# EasyEDA Pro project MSDRV4.eprj, board PCB10_1
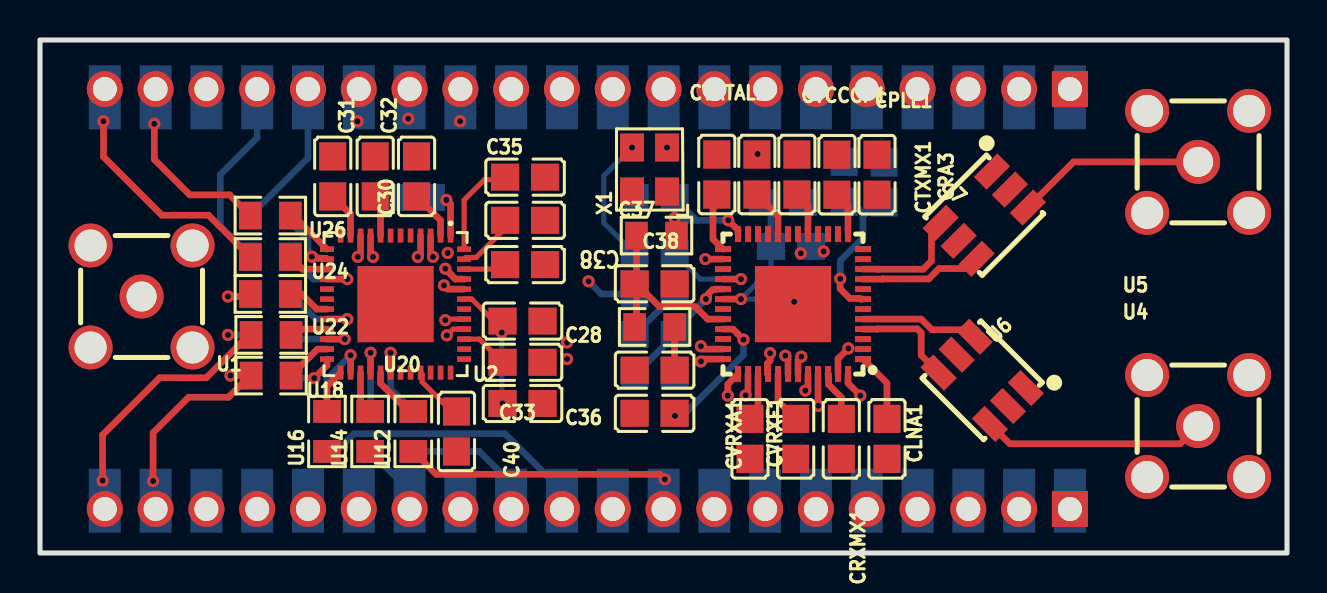
[diagram p10: board, top side]
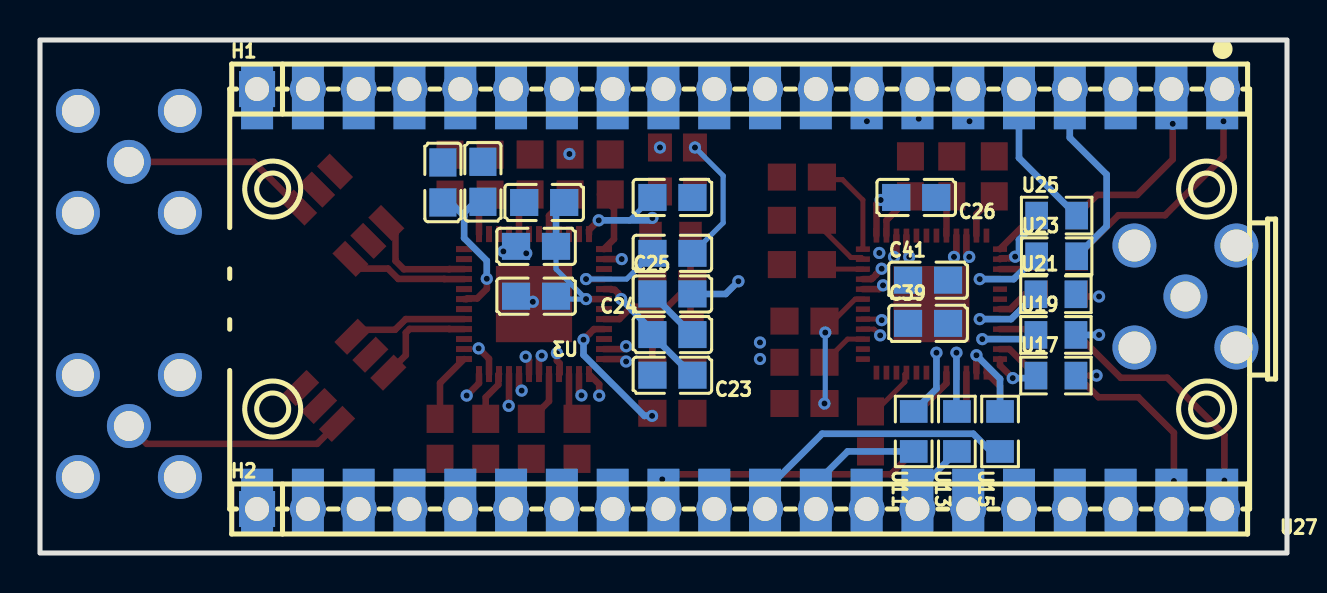
[diagram p11: board, bottom side, seen from below]

Outline 62.36 x 25.65 mm; copper layers: Top Layer, GND, Inner2, Inner3, 3.3, Bottom Layer. Coordinates in mm from the lower left corner of the outline.
Outline path: rectangle 0,25.65 62.36,0
Stack: Top Layer 0.035mm Outer layer thickness 1oz / Dielectric1 0.0994mm 3313 RC57% 4.2mil / GND 0.0152mm Inner layer thickness / Dielectric2 0.55mm 0.55mm H/H No copper / Inner2 0.0152mm Inner layer thickness / Dielectric3 0.1088mm 2116 RC54% 4.9mil / Inner3 0.0152mm Inner layer thickness / Dielectric4 0.55mm 0.55mm H/H No copper / 3.3 0.0152mm Inner layer thickness / Dielectric5 0.0994mm 3313 RC57% 4.2mil / Bottom Layer 0.035mm Outer layer thickness 1oz

## Design rules (mm)
net $1I297\RXP: $1I297\RX
net $1I297\RXN: $1I297\RX
net $1I297\TXP: $1I297\TX
net $1I297\TXN: $1I297\TX
net RXQN: RXQ
net RXQP: RXQ
net RXIN: RXI
net RXIP: RXI
net TXQN: TXQ
net TXQP: TXQ
net TXIN: TXI
net TXIP: TXI
template: JLCPCB Capability(Two Layers Board)
spacing copperThickness1oz (default): track to track 0.102, other pairs 0.152 to 0.3
spacing copperThickness2oz: track to track 0.203, other pairs 0.152 to 0.3
track width copperThickness1oz (default): min 0.127, default 0.254, max 2.54
track width copperThickness2oz: min 0.203, default 0.254, max 2.54
differential pair differentialPair (default): width min 0.127, default 0.254, max 2.54; gap min 0.152, default 0.152
via viaSize (default): diameter min 0.5, default 0.61, max 10; hole min 0.3, default 0.305, max 6.3

## Placement (name value [footprint] x y rotation side)
C18  100nF  [C0805]  30.73 6.98 0 top
C19  1nF  [C0805]  30.73 14.99 0 bottom
C20  100pF  [C0805]  30.73 17.78 0 bottom
C21  2200pF  [C0805]  30.73 9.14 0 top
C22  68pF  [C0805]  30.73 13.46 180 top
C23  18pF  [C0805]  30.73 8.89 0 bottom
C24  100nF  [C0805]  30.73 10.92 180 bottom
C25  100nF  [C0805]  30.73 12.95 180 bottom
C26  330nF  [C0805]  18.54 17.78 0 bottom
C28  100nF  [C0805]  24.13 11.6 180 top
C30  100nF  [C0805]  18.83 18.83 90 top
C31  100nF  [C0805]  14.64 18.83 270 top
C32  100nF  [C0805]  16.76 18.83 270 top
C33  100nF  [C0805]  24.13 9.54 0 top
C35  330nF  [C0805]  24.26 18.8 0 top
C36  100nF  [C0805]  24.13 7.48 180 top
C37  330nF  [C0805]  24.26 16.64 180 top
C38  100nF  [C0805]  24.26 14.42 180 top
C39  100nF  [C0805]  17.95 11.48 180 bottom
C40  100nF  [C0805]  20.83 6.08 90 top
C41  100nF  [C0805]  17.95 13.64 180 bottom
CLNA1  100pF  [C0805]  42.35 5.71 270 top
CPA1  10uF  [C0805]  40.21 18.56 90 bottom
CPA2  10uF  [C0805]  42.21 18.53 90 bottom
CPA3  100nF  [C0805]  41.85 18.92 90 top
CPLL1  100pF  [C0805]  37.85 18.93 90 top
CRXMX1  100pF  [C0805]  40.07 5.71 270 top
CTXMX1  100pF  [C0805]  39.85 18.92 90 top
CVCCCP1  10nF  [C0805]  35.85 18.93 90 top
CVCO0  100pF  [C0805]  37.55 15.33 0 bottom
CVCO1  100pF  [C0805]  37.55 12.84 0 bottom
CVCO2  100pF  [C0805]  37.15 17.53 0 bottom
CVRXA1  100pF  [C0805]  35.5 5.71 270 top
CVRXF1  100pF  [C0805]  37.79 5.71 270 top
CVXTAL1  100pF  [C0805]  33.84 18.93 90 top
H1  -  [HDR-TH_20P-P2.54-V-M-1]  27.37 23.2 180 bottom
H2  -  [HDR-TH_20P-P2.54-V-M-1]  27.37 2.2 180 bottom
U1  MCX5.08-H5  [SMA-TH_MCX5.08-H5]  5.08 12.83 180 top
U2  MAX5864ETM+  [QFN-48_L7.0-W7.0-P0.50-BL-EP5.1]  17.78 12.45 180 top
U3  MAX2831ETM+T  [TQFN-48_L7.0-W7.0-P0.50-TL-EP5.6]  37.65 12.45 180 top
U4  MCX5.08-H5  [SMA-TH_MCX5.08-H5]  57.91 6.35 0 top
U5  MCX5.08-H5  [SMA-TH_MCX5.08-H5]  57.91 19.56 0 top
U6  TCM2-43X+  [IND-SMD_6P-L4.1-W3.8-P1.27-TL]  47.12 8.64 225 top
U7  TCM2-43X+  [IND-SMD_6P-L4.1-W3.8-P1.27-TL]  47.22 16.89 315 top
U8  1.2K  [R0805]  30.73 11.3 0 top
U9  750  [R0805]  30.83 15.88 0 top
U11  100  [R0805]  18.67 6.08 90 bottom
U12  100  [R0805]  18.67 6.08 90 top
U13  100  [R0805]  16.51 6.08 90 bottom
U14  100  [R0805]  16.51 6.08 90 top
U15  100  [R0805]  14.35 6.08 90 bottom
U16  100  [R0805]  14.35 6.08 90 top
U17  100  [R0805]  11.56 8.87 180 bottom
U18  100  [R0805]  11.56 8.87 180 top
U19  100  [R0805]  11.56 10.91 180 bottom
U20  100  [R0805]  11.56 10.91 180 top
U21  100  [R0805]  11.56 12.94 180 bottom
U22  100  [R0805]  11.52 12.95 180 top
U23  100  [R0805]  11.52 14.84 180 bottom
U24  100  [R0805]  11.52 14.8 180 top
U25  100  [R0805]  11.52 16.87 180 bottom
U26  100  [R0805]  11.52 16.87 180 top
U27  PICO  [comm-smd_l51.0-w21.0-p2.54_sc0916]  27.69 12.7 0 bottom
X1  40MHz  [OSC-SMD_4P-L3.2-W2.5-BL]  30.48 19.18 90 top

## Footprints (pads in the part's own frame, mm; a bottom-side part is the same pattern mirrored in y, then rotated)
C0805
  rect 1.41x1.35 smd: 1(-1,0) 2(1,0)
comm-smd_l51.0-w21.0-p2.54_sc0916
  rect 1.6x3.2 smd: 1(-24.445,-10.088) 2(-21.905,-10.088) 3(-19.365,-10.088) 4(-16.825,-10.088) 5(-14.285,-10.088) 6(-11.745,-10.088) 7(-9.205,-10.088) 8(-6.665,-10.088) 9(-4.125,-10.088) 10(-1.585,-10.088) 11(0.955,-10.088) 12(3.495,-10.088) 13(6.035,-10.088) 14(8.575,-10.088) 15(11.115,-10.088) 16(13.655,-10.088) 17(16.195,-10.088) 18(18.735,-10.088) 19(21.275,-10.088) 20(23.815,-10.088) 21(23.815,10.088) 22(21.275,10.088) 23(18.735,10.088) 24(16.195,10.088) 25(13.655,10.088) 26(11.115,10.088) 27(8.575,10.088) 28(6.035,10.088) 29(3.495,10.088) 30(0.955,10.088) 31(-1.585,10.088) 32(-4.125,10.088) 33(-6.665,10.088) 34(-9.205,10.088) 35(-11.745,10.088) 36(-14.285,10.088) 37(-16.825,10.088) 38(-19.365,10.088) 39(-21.905,10.088) 40(-24.445,10.088)
HDR-TH_20P-P2.54-V-M-1
  rect 1.8x1.8 hole 1.2: 1(-24.13,0)
  round 1.8 hole 1.2: 2(-21.59,0) 3(-19.05,0) 4(-16.51,0) 5(-13.97,0) 6(-11.43,0) 7(-8.89,0) 8(-6.35,0) 9(-3.81,0) 10(-1.27,0) 11(1.27,0) 12(3.81,0) 13(6.35,0) 14(8.89,0) 15(11.43,0) 16(13.97,0) 17(16.51,0) 18(19.05,0) 19(21.59,0) 20(24.13,0)
IND-SMD_6P-L4.1-W3.8-P1.27-TL
  rect 0.9x1.657 smd: 1(-1.27,1.813) 2(0,1.813) 3(1.27,1.813) 4(1.27,-1.813) 5(0,-1.813) 6(-1.27,-1.813)
OSC-SMD_4P-L3.2-W2.5-BL
  rect 1.4x1.2 smd: 1(-1.1,-0.875) 2(1.1,-0.875) 3(1.1,0.875) 4(-1.1,0.875)
QFN-48_L7.0-W7.0-P0.50-BL-EP5.1
  rect 0.28x0.7 smd: 1(-2.75,-3.428) 2(-2.25,-3.428) 3(-1.75,-3.428) 4(-1.25,-3.428) 5(-0.75,-3.428) 6(-0.25,-3.428) 7(0.25,-3.428) 8(0.75,-3.428) 9(1.25,-3.428) 10(1.75,-3.428) 11(2.25,-3.428) 12(2.75,-3.428) 25(2.75,3.428) 26(2.25,3.428) 27(1.75,3.428) 28(1.25,3.428) 29(0.75,3.428) 30(0.25,3.428) 31(-0.25,3.428) 32(-0.75,3.428) 33(-1.25,3.428) 34(-1.75,3.428) 35(-2.25,3.428) 36(-2.75,3.428)
  rect 0.7x0.28 smd: 13(3.428,-2.75) 14(3.428,-2.25) 15(3.428,-1.75) 16(3.428,-1.25) 17(3.428,-0.75) 18(3.428,-0.25) 19(3.428,0.25) 20(3.428,0.75) 21(3.428,1.25) 22(3.428,1.75) 23(3.428,2.25) 24(3.428,2.75) 37(-3.428,2.75) 38(-3.428,2.25) 39(-3.428,1.75) 40(-3.428,1.25) 41(-3.428,0.75) 42(-3.428,0.25) 43(-3.428,-0.25) 44(-3.428,-0.75) 45(-3.428,-1.25) 46(-3.428,-1.75) 47(-3.428,-2.25) 48(-3.428,-2.75)
  rect 3.81x3.81 smd: 49(0,0)
R0805
  rect 1.133x1.377 smd: 1(-1,0) 2(1,0)
SMA-TH_MCX5.08-H5
  round 2.2 hole 1.6: 1(-2.55,-2.55) 2(-2.55,2.55) 3(2.55,2.55) 4(2.55,-2.55)
  round 2.2 hole 1.5: 5(0,0)
TQFN-48_L7.0-W7.0-P0.50-TL-EP5.6
  rect 0.8x0.3 smd: 1(-3.5,2.751) 2(-3.5,2.251) 3(-3.5,1.75) 4(-3.5,1.251) 5(-3.5,0.75) 6(-3.5,0.252) 7(-3.5,-0.249) 8(-3.5,-0.75) 9(-3.5,-1.25) 10(-3.5,-1.75) 11(-3.5,-2.249) 12(-3.5,-2.748) 25(3.5,-2.748) 26(3.5,-2.249) 27(3.5,-1.75) 28(3.5,-1.25) 29(3.5,-0.75) 30(3.5,-0.249) 31(3.5,0.252) 32(3.5,0.75) 33(3.5,1.251) 34(3.5,1.75) 35(3.5,2.251) 36(3.5,2.751)
  rect 0.3x0.8 smd: 13(-2.751,-3.5) 14(-2.251,-3.5) 15(-1.75,-3.5) 16(-1.25,-3.5) 17(-0.75,-3.5) 18(-0.251,-3.5) 19(0.249,-3.5) 20(0.75,-3.5) 21(1.25,-3.5) 22(1.75,-3.5) 23(2.251,-3.5) 24(2.751,-3.5) 37(2.751,3.5) 38(2.251,3.5) 39(1.75,3.5) 40(1.25,3.5) 41(0.75,3.5) 42(0.251,3.5) 43(-0.251,3.5) 44(-0.75,3.5) 45(-1.25,3.5) 46(-1.75,3.5) 47(-2.251,3.5) 48(-2.751,3.5)
  rect 3.81x3.81 smd: 49(0,0.001)

## Nets
+5V: X1.4
GND: C18.1 C20.1 C21.1 C22.1 C23.2 C26.1 C28.1 C30.2 C31.1 C32.1 C33.2 C35.2 C36.1 C37.1 C38.1 C39.1 C40.1 C41.1 CLNA1.2 CPA1.2 CPA2.2 CPA3.2 CPLL1.2 CRXMX1.2 CTXMX1.2 CVCCCP1.2 CVCO0.2 CVCO1.2 CVCO2.2 CVRXA1.2 CVRXF1.2 CVXTAL1.2 U1.1 U1.2 U1.3 U1.4 U2.5 U2.7 U2.12 U2.31 U2.32 U2.37 U2.42 U3.2 U3.26 U3.31 U3.47 U3.49 U4.1 U4.2 U4.3 U4.4 U5.1 U5.2 U5.3 U5.4 U6.1 U6.2 U7.1 U7.2 X1.2
VCC: C28.2 C30.1 C31.2 C32.2 C33.1 C36.2 C38.2 C39.2 C40.2 C41.2 U2.2 U2.8 U2.11 U2.18 U2.33 U2.39 U2.43 U2.46
3.3: CLNA1.1 CPA1.1 CPA2.1 CPA3.1 CPLL1.1 CRXMX1.1 CTXMX1.1 CVCCCP1.1 CVCO0.1 CVCO1.1 CVCO2.1 CVRXA1.1 CVRXF1.1 CVXTAL1.1 U3.1 U3.7 U3.13 U3.17 U3.20 U3.25 U3.27 U3.30 U3.39 U3.41 U3.46
$1I61\$1N1602: C37.2 U2.47
$1I61\$1N1605: U2.30 U11.2
$1I61\$1N1608: U2.29 U12.2
$1I61\$1N1611: U2.28 U13.2
$1I61\$1N1614: U2.27 U14.2
$1I61\$1N1617: U2.26 U15.2
$1I61\$1N1620: U2.25 U16.2
$1I61\$1N1625: U2.24 U17.1
$1I61\$1N1628: U2.23 U18.1
$1I61\$1N1633: U2.21 U20.1
$1I61\$1N1636: U2.20 U21.1
$1I61\$1N1639: U2.19 U22.1
$1I61\$1N1642: U2.16 U23.1
$1I61\$1N1645: U2.15 U24.1
$1I61\$1N1648: U2.14 U25.1
$1I61\$1N1651: U2.13 U26.1
$1I61\$1N1653: C35.1 U2.48
$1I61\$1N1654: C26.2 U2.1
$1I61\$1N1662: U2.22 U19.1
$1I61\BBC_CLK: U2.6
$1I61\BBC_DA0: U26.2 U27.2
$1I61\BBC_DA1: U25.2 U27.5
$1I61\BBC_DA2: U24.2 U27.1
$1I61\BBC_DA3: U23.2 U27.4
$1I61\BBC_DA4: U22.2 U27.6
$1I61\BBC_DA5: U21.2
$1I61\BBC_DA6: U20.2 U27.40
$1I61\BBC_DA7: U19.2 U27.7
$1I61\BBC_DD0: U18.2 U27.8 U27.39
$1I61\BBC_DD1: U17.2
$1I61\BBC_DD2: U16.1
$1I61\BBC_DD3: U15.1 U27.31
$1I61\BBC_DD4: U14.1
$1I61\BBC_DD5: U13.1 U27.34
$1I61\BBC_DD6: U12.1 U27.29
$1I61\BBC_DD7: U11.1 U27.32
$1I61\CS#: U2.36
$1I61\DIN: U2.34
$1I61\SCLK: U2.35
$1I297\$1N1513: U4.5 U6.3
$1I297\$1N1514: U5.5 U7.3
$1I297\$1N1515: C21.2 U8.2
$1I297\$1N2254: C23.1 C24.1 U3.29
$1I297\$1N2490: C19.1 X1.3
$1I297\$1N3884: C25.2 U1.5
$1I297\BYPASS: C18.2 U3.33
$1I297\CLKBUF: U3.21
$1I297\CPOUT: C20.2 U3.24 U9.2
$1I297\CS#: U3.15
$1I297\D1: U3.23
$1I297\D2: U3.11
$1I297\D3: U3.8
$1I297\D4: U3.34
$1I297\D5: U3.14
$1I297\D6: U3.3
$1I297\D7: U3.6
$1I297\DIN: U3.19
$1I297\PLL_LOCK: U3.22
$1I297\RSSI: U3.16
$1I297\RXHP: U3.40
$1I297\RXN: U3.5 U6.6
$1I297\RXP: U3.4 U6.4
$1I297\RXTX_MODE: U3.48
$1I297\SCLK: U3.18
$1I297\SHDN#: U3.12 X1.1
$1I297\TUNE: C22.2 U3.32 U8.1 U9.1
$1I297\TXN: U3.10 U7.6
$1I297\TXP: U3.9 U7.4
$1I297\XTAL: C19.2 C24.2 C25.1 U3.28
RXIN: U2.4 U3.37
RXIP: U2.3 U3.38
RXQN: U2.9 U3.35
RXQP: U2.10 U3.36
TXIN: U2.44 U3.44
TXIP: U2.45 U3.45
TXQN: U2.40 U3.42
TXQP: U2.41 U3.43

Pads without a net: H1 1 2 3 4 5 6 7 8 9 10 11 12 13 14 15 16 17 18 19 20; H2 1 2 3 4 5 6 7 8 9 10 11 12 13 14 15 16 17 18 19 20; U2 17 38 49; U6 5; U7 5; U27 3 9 10 11 12 13 14 15 16 17 18 19 20 21 22 23 24 25 26 27 28 30 33 35 36 37 38

## Via types
v1: diameter 0.61, hole 0.305, Top Layer to Bottom Layer, 60 vias

## Routing (per net, layer and track width the routed paths; a pad name or vN(x,y) marks a point on that pad's centre or on a via; arc(x,y) is an arc through that point)
GND: length 2.4
  Top Layer w0.33: U3.47 39.9,9.71 v1(40.42,10.23) ; 34.15,14.7 33.27,14.7
  vias: v1(31.36,20.28) v1(33.27,14.7) v1(35.88,19.95) v1(37.71,12.56) v1(38.04,14.99) v1(39.19,15.08)
VCC: length 20
  Top Layer w0.254: v1(23.09,11.02) 23.09,11.56 C28.2 22.69,11.6 21.59,12.7 U2.43 ; 22.59,14.2 U2.46 ; C33.1 21.97,10.7 U2.39 ; U2.33 19.11,8.94 19.11,8.55 20.58,7.08 C40.2
  Top Layer w0.33: C31.2 15.53,16.94 U2.11 ; U2.8 17.03,17.56 C32.2 ; C30.1 20.03,16.63 U2.2
  Bottom Layer w0.254: v1(23.09,11.02) 23.09,7.52 v1(23.13,7.48)
3.3: length 37.6
  Top Layer w0.33: U3.30 v1(35.05,12.7) ; U3.13 40.4,17.36 CTXMX1.1 ; U3.7 41.03,12.7 40.99,12.73 40.5,12.73 40.01,13.22 40.01,13.71 v1(40.02,13.71) ; U3.41 36.9,7.59 CVRXF1.1 ; CPLL1.1 38.4,17.37 U3.17 ; 34.35,17.93 33.65,17.23 33.65,15.7 U3.25 ; CVRXA1.1 35.9,7.11 U3.39 ; CLNA1.1 42.35,8.5 41.15,9.7 ; U3.46 39.44,8.91 39.44,8.42 40.07,7.78 CRXMX1.1 ; U3.20 36.9,16.87 CVCCCP1.1
  Bottom Layer w0.254: CVCO1.1 36.41,12.7 v1(35.05,12.7) 36.55,14.2 CVCO0.1
  Bottom Layer w0.33: 40.21,17.94 41.15,17 41.15,16.85 ; 41.15,16.85 41.15,15.75 40.02,14.62 v1(40.02,13.71) ; 41.15,16.85 42.21,17.91 ; CVCO2.1 36.55,17.12 CVCO0.1
  vias: v1(20.39,15)
$1I61\$1N1602: length 3.1
  Top Layer w0.254: C37.2 23.13,16.51 23.13,16.1 21.81,14.78 21.29,14.78 U2.47
$1I61\$1N1605: length 4.4
  Top Layer w0.33: U2.30 v1(17.53,10.02)
  Bottom Layer w0.33: v1(17.53,10.02) 17.53,8.22 U11.2
$1I61\$1N1608: length 2.8
  Top Layer w0.33: U2.29 17.03,8.48 18.43,7.08 U12.2
$1I61\$1N1611: length 3.9
  Top Layer w0.33: U2.28 v1(16.53,10.02)
  Bottom Layer w0.33: v1(16.53,10.02) 16.53,7.1 U13.2
$1I61\$1N1614: length 2.1
  Top Layer w0.33: U2.27 16.03,7.56 U14.2
$1I61\$1N1617: length 4.2
  Top Layer w0.33: U2.26 v1(15.53,9.89)
  Bottom Layer w0.33: U15.2 14.35,8.71 v1(15.53,9.89)
$1I61\$1N1620: length 2.2
  Top Layer w0.33: U16.2 14.35,8.34 U2.25
$1I61\$1N1625: length 2.4
  Top Layer w0.33: v1(13.71,8.75) 14.35,9.38 U2.24
  Bottom Layer w0.33: U17.1 12.68,8.75 v1(13.71,8.75)
$1I61\$1N1628: length 2.3
  Top Layer w0.33: U18.1 13.88,10.2 U2.23
$1I61\$1N1633: length 1.9
  Top Layer w0.33: U2.21 12.85,11.2 U20.1
$1I61\$1N1636: length 4.3
  Top Layer w0.33: U2.20 v1(15.37,11.7)
  Bottom Layer w0.33: U21.1 13.8,11.7 v1(15.37,11.7)
$1I61\$1N1639: length 2.1
  Top Layer w0.33: U2.19 13.84,12.2 13.08,12.95 U22.1
$1I61\$1N1642: length 4.3
  Top Layer w0.33: U2.16 v1(15.37,13.7)
  Bottom Layer w0.33: v1(15.37,13.7) 13.67,13.7 U23.1
$1I61\$1N1645: length 2.1
  Top Layer w0.33: U2.15 13.12,14.2 U24.1
$1I61\$1N1648: length 3.3
  Top Layer w0.33: U2.14 14.31,14.74 13.87,14.74 13.79,14.82 v1(13.6,14.82)
  Bottom Layer w0.33: v1(13.6,14.82) 13.4,15.01 13.4,15.66 12.52,16.55 U25.1
$1I61\$1N1651: length 2.5
  Top Layer w0.33: U2.13 12.67,16.87 U26.1
$1I61\$1N1653: length 4.9
  Top Layer w0.254: U2.48 21.21,17.65 22.23,18.67 23.26,18.67
$1I61\$1N1654: length 2.7
  Top Layer w0.33: v1(20.32,17.65) 20.53,17.44 U2.1
  Bottom Layer w0.33: C26.2 19.67,17.65 v1(20.32,17.65)
$1I61\$1N1662: length 3.7
  Top Layer w0.33: U2.22 v1(15.24,10.7)
  Bottom Layer w0.33: U19.1 12.76,10.7 v1(15.24,10.7)
$1I61\BBC_DA0: length 7.7
  Top Layer w0.33: U26.2 9.49,17.91 7.49,17.91 5.72,19.69 v1(5.72,21.46)
$1I61\BBC_DA1: length 7.1
  Bottom Layer w0.33: U25.2 13.4,19.76 U27.5
$1I61\BBC_DA2: length 11.2
  Top Layer w0.33: v1(3.17,21.59) 3.17,19.81 6.1,16.89 8.43,16.89 U24.2
$1I61\BBC_DA3: length 9.3
  Bottom Layer w0.33: U23.2 9.02,16.34 9.02,18.92 10.86,20.77 U27.4
$1I61\BBC_DA4: length 12.6
  Top Layer w0.33: U22.2 10.39,12.83 v1(9.4,12.83)
  Inner2 w0.33: v1(9.4,12.83) 15.88,19.3 v1(15.88,21.59)
$1I61\BBC_DA6: length 11.7
  Top Layer w0.33: 10.47,10.92 8.32,8.76 5.98,8.76 3.13,5.91 v1(3.13,3.62)
$1I61\BBC_DA7: length 15.7
  Inner2 w0.33: v1(18.42,21.72) 18.42,20.52 9.4,11.5 v1(9.4,10.91)
  Bottom Layer w0.33: U19.2 v1(9.4,10.91)
$1I61\BBC_DD0: length 26.8
  Top Layer w0.33: 10.46,8.82 9.43,7.79 7.43,7.79 5.65,6.01 v1(5.65,3.6) ; U18.2 v1(9.53,8.87)
  Inner2 w0.33: v1(9.53,8.87) 14.73,14.08 14.73,14.73 21.08,21.08 21.08,21.46
  vias: v1(21.01,21.59)
$1I61\BBC_DD3: length 13.8
  Bottom Layer w0.33: U15.1 14.8,5.08 15.69,5.96 23.25,5.96 26.1,3.11 U27.31
$1I61\BBC_DD5: length 3.3
  Bottom Layer w0.33: U27.34 18.48,3.11 U13.1
$1I61\BBC_DD6: length 14.2
  Top Layer w0.33: U12.1 19.81,3.94 30.99,3.94 v1(31.24,3.68)
  Bottom Layer w0.33: U27.29 31.24,2.67 v1(31.24,3.68)
$1I61\BBC_DD7: length 6.4
  Bottom Layer w0.33: U27.32 23.56,3.49 21.97,5.08 U11.1
$1I297\$1N1513: length 11.2
  Top Layer w0.33: U6.3 48.5,5.46 57.02,5.46 U4.5
$1I297\$1N1514: length 9.5
  Top Layer w0.33: U5.5 51.68,19.56 U7.3
$1I297\$1N1515: length 2.2
  Top Layer w0.33: U8.2 C21.2
$1I297\$1N2254: length 6.4
  Top Layer w0.33: v1(33.3,12.7) 33.44,12.84 33.44,12.98 33.62,13.16 33.76,13.16 33.79,13.2 U3.29
  Bottom Layer w0.33: v1(33.3,12.7) 32.76,12.16 32.76,12.15 31.73,11.13 C24.1 31.73,10.89 C23.1
$1I297\$1N2490: length 6.5
  Bottom Layer w0.254: C19.1 29.72,14.99 28.19,16.51 28.19,18.87 v1(29.61,20.28)
$1I297\$1N3884: length 27.5
  Inner3 w0.33: v1(27.43,13.59) 24.64,16.38 11.81,16.38 8.25,12.83 U1.5
  Bottom Layer w0.33: C25.2 28.07,12.95 v1(27.43,13.59)
$1I297\BYPASS: length 6.8
  Top Layer w0.33: C18.2 31.73,6.87 v1(31.75,6.86) ; v1(35.18,10.67) 34.87,10.98 34.87,10.98 34.68,11.17 34.68,11.17 34.65,11.2 U3.33
  Bottom Layer w0.33: v1(35.18,10.67) 35.18,9.91 32.13,6.86 v1(31.75,6.86)
$1I297\CPOUT: length 6.2
  Top Layer w0.33: v1(31.73,16.76) 31.73,15.97 U9.2 ; v1(34.42,16.64) 34.9,16.15 U3.24
  Bottom Layer w0.254: 32.88,16.64 C20.2
  Bottom Layer w0.33: v1(31.73,16.76) 31.85,16.64 v1(34.42,16.64)
$1I297\RXHP: length 1.1
  Top Layer w0.33: U3.40 36.37,8.98 36.37,9.48 36.51,9.62 v1(36.51,9.99)
$1I297\RXN: length 5.9
  Top Layer w0.33: U3.5 44.07,11.7 44.6,11.16 46.26,11.16 46.61,10.82 U6.6
$1I297\RXP: length 5.4
  Top Layer w0.33: U3.4 41.88,11.2 41.89,11.21 43.88,11.21 44.06,11.02 44.06,9.89 U6.4
$1I297\RXTX_MODE: length 1.3
  Top Layer w0.33: v1(41.02,7.87) 40.4,8.49 U3.48
$1I297\TUNE: length 9.7
  Top Layer w0.33: 29.83,13.46 30.97,12.32 32.77,12.32 33.39,11.7 U3.32 ; 29.83,13.46 29.83,11.4 U8.1 ; 29.83,13.46 U9.1
$1I297\TXN: length 6.2
  Top Layer w0.33: U3.10 41.88,14.2 41.89,14.19 44.16,14.19 44.58,14.6 44.58,16.05 45.42,16.89
$1I297\TXP: length 6.8
  Top Layer w0.33: 47.22,15.09 47.22,14.84 46.6,14.22 44.96,14.22 44.44,13.71 42.15,13.71 42.14,13.7 U3.9
$1I297\XTAL: length 7.6
  Top Layer w0.33: v1(35.05,13.7) U3.28
  Bottom Layer w0.254: v1(35.05,13.7) 33.02,13.7 C19.2
  Bottom Layer w0.33: C24.2 31.73,12.92 C25.1
RXIN: length 22.9
  Top Layer w0.33: U3.37 34.39,8.44 v1(34.39,7.87) ; v1(18.89,14.81) 19.03,14.95 U2.4
  Inner3 w0.33: v1(34.39,7.87) 34.39,9.37 33.67,10.09 33.67,10.6 32.71,11.56 24.18,11.56 23.47,12.27 19.76,12.27 19.1,12.93 19.1,14.48 19.03,14.55 19.03,14.67 v1(18.89,14.81)
RXIP: length 22.7
  Top Layer w0.33: U3.38 35.4,8 ; U2.3 19.53,14.93 v1(19.65,14.81)
  Inner3 w0.33: v1(35.28,7.88) 35.28,8.52 35.08,8.72 35.08,9.37 34.15,10.29 34.15,10.8 32.88,12.06 24.36,12.06 23.66,12.76 19.94,12.76 19.58,13.13 19.58,14.73 v1(19.65,14.81)
RXQN: length 22.1
  Top Layer w0.33: v1(16.65,14.81) 16.53,14.93 U2.9 ; U3.35 33.19,10.2 v1(33.05,10.34)
  Inner2 w0.33: v1(16.65,14.81) 16.52,14.68 16.52,14.6 16.64,14.49 16.64,13.32 19.95,10.01 25.13,10.01 25.38,10.26 25.45,10.26 25.58,10.39 ; v1(26.35,10.53) 25.72,10.53 25.58,10.39 ; 25.65,10.39 25.58,10.39
  Inner3 w0.33: v1(26.35,10.53) 26.99,10.53 27.16,10.36 28.05,10.36 28.21,10.2 32.27,10.2 32.41,10.34 v1(33.05,10.34)
RXQP: length 22.8
  Top Layer w0.33: U2.10 16.03,14.95 v1(15.89,14.81) ; v1(33.05,9.58) 33.17,9.7 34.15,9.7
  Inner2 w0.33: v1(15.89,14.81) 15.89,14.55 16.16,14.29 16.16,13.12 19.75,9.52 25.33,9.52 25.58,9.78 26.28,9.78 v1(26.35,9.7)
  Inner3 w0.33: v1(26.35,9.7) 26.99,9.7 27.16,9.87 27.85,9.87 28.01,9.72 32.27,9.72 32.41,9.58 v1(33.05,9.58)
TXIN: length 27.8
  Top Layer w0.33: U2.44 20.39,13.2 v1(20.2,13.39) ; v1(38.27,8.12) 38.4,8.25 U3.44
  Inner2 w0.33: v1(20.2,13.39) 20.83,13.39 21.01,13.56 21.61,13.56 23.54,15.49 34.56,15.49 36.17,13.88 37.63,13.88 39.3,12.21 39.3,9.15 v1(38.27,8.12)
TXIP: length 30.2
  Top Layer w0.33: U2.45 20.79,13.7 20.75,13.74 20.73,13.74 20.54,13.92 20.54,13.94 v1(20.27,14.22) ; v1(38.92,7.36) 38.9,7.38 U3.45
  Inner2 w0.33: 23.24,15.88 21.41,14.04 21.08,14.04 20.9,14.22 v1(20.27,14.22) ; 23.24,15.88 23.11,15.88 ; 23.24,15.88 23.34,15.98 34.76,15.98 ; 34.76,15.98 36.37,14.36 37.83,14.36 39.8,12.39 39.8,8.61 39.37,8.17 39.37,7.81 v1(38.92,7.36) ; 34.76,15.98 34.73,16
TXQN: length 21.8
  Top Layer w0.254: v1(20.34,10.88) 20.66,11.2 U2.40
  Top Layer w0.33: U3.42 37.4,9.74 v1(37.27,9.87)
  Inner2 w0.33: v1(20.34,10.88) 20.98,10.88 21.12,11.02 21.57,11.02 23.31,12.76 25.8,12.76 26.97,11.59 36.83,11.59 37.43,10.99 37.43,10.66 37.27,10.5 v1(37.27,9.87)
TXQP: length 22.6
  Top Layer w0.254: v1(20.27,11.64) 20.32,11.7 U2.41
  Top Layer w0.33: v1(38.07,9.82) 37.9,9.65 37.9,8.95
  Inner2 w0.33: v1(20.27,11.64) 20.35,11.56 20.99,11.56 22.67,13.24 26,13.24 27.17,12.08 37.03,12.08 38,11.11 38,10.53 38.15,10.37 38.15,9.9 v1(38.07,9.82)

## Copper pours and planes (outline as drawn; the poured copper is in the pictures)
GND on GND: 0.26,25.78 62.1,25.78 62.1,0.64 0.26,0.64
3.3 on 3.3: 0.26,25.78 62.1,25.78 62.1,0.64 0.26,0.64

Small or netless copper shapes (teardrops, artwork), in the pictures only: 48 on GND

## Text on the board
Top Silkscreen Layer: C38
